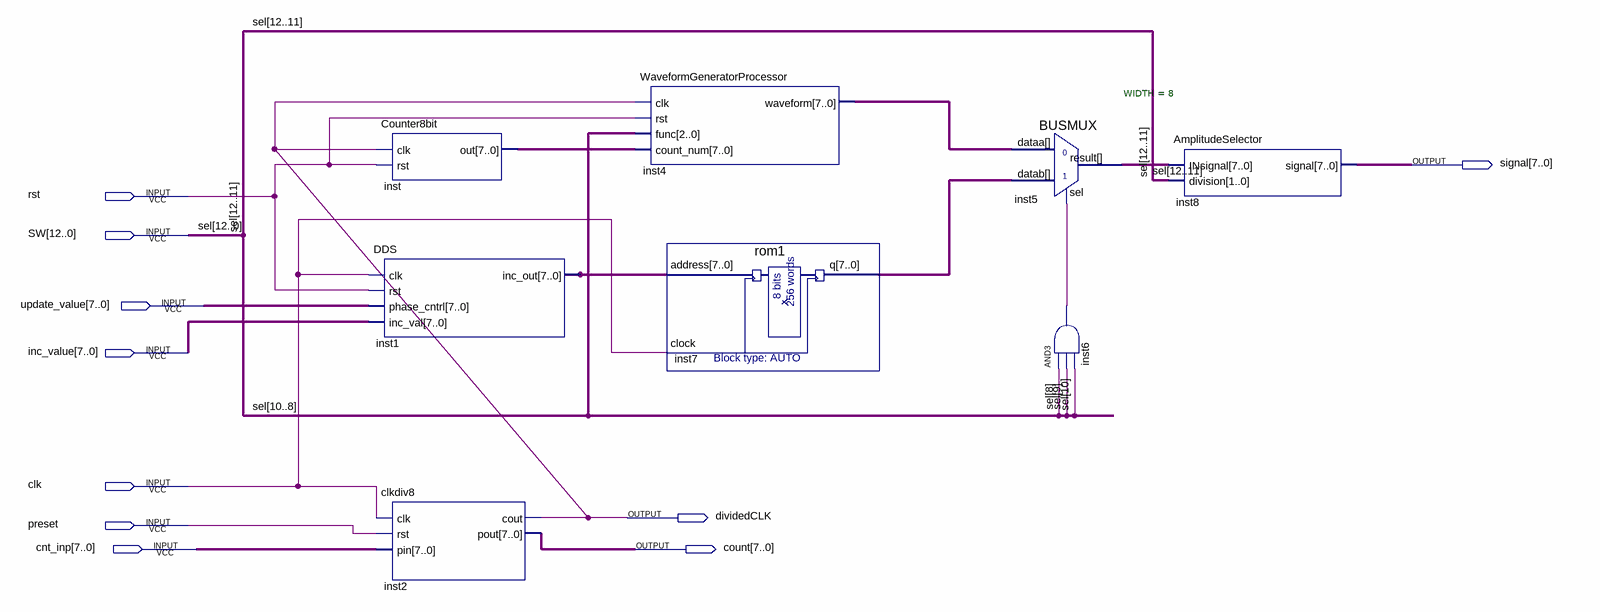
[diagram p0: schematic sheet]
// Quartus schematic WaveformGenFreqSelecAmpSelec.bdf as structural Verilog: 8 symbols, 10 pins
module WaveformGenFreqSelecAmpSelec (
  input  rst,
  input  [12:0] SW,
  input  [7:0] update_value,
  input  [7:0] inc_value,
  input  clk,
  input  preset,
  input  [7:0] cnt_inp,
  output [7:0] signal,
  output dividedCLK,
  output [7:0] count
);

  wire inst6_out;
  wire [7:0] inst1_inc_out, inst4_waveform, inst5_result, inst7_q, inst_out;

  Counter8bit inst (.clk(dividedCLK), .rst(rst), .out(inst_out));
  DDS inst1 (.clk(clk), .rst(rst), .phase_cntrl(update_value), .inc_val(inc_value), .inc_out(inst1_inc_out));
  clkdiv8 inst2 (.clk(clk), .rst(preset), .pin(cnt_inp), .cout(dividedCLK), .pout(count));
  WaveformGeneratorProcessor inst4 (
    .clk(dividedCLK), .rst(rst), .func(SW), .count_num(inst_out), .waveform(inst4_waveform));
  rom1 inst7 (.address(inst1_inc_out), .clock(clk), .q(inst7_q));
  BUSMUX #(.WIDTH(8)) inst5 (.datab(inst7_q), .sel(inst6_out), .dataa(inst4_waveform), .result(inst5_result));
  and inst6 (inst6_out, SW[8], SW[9], SW[10]);
  AmplitudeSelector inst8 (.INsignal(inst5_result), .division(SW[12:11]), .signal(signal));

  // Other names for the same wires on the sheet: sel[12:0] = SW
endmodule
